# Altium schematic sheet IOControl.SchDoc: Top Level
size A3; CompanyName: NOT USED; SheetNumber: 0; SheetTotal: 0; PageSetup: Record=PageOptions|CenterHorizontal=True|CenterVertical=True|PrintScale=1.00|XCorrection=1.00|YCorrection=1.00|PrintKind=0|BorderSize=5000000|LeftOffset=0|BottomOffset=0|Orientation=2|PaperLength=1000|PaperWidth=1000|Scale=100|PaperSource=7|PrintQuality=-4|MediaType=1|DitherType=10|PaperKind=A3|PrintScaleMode=0
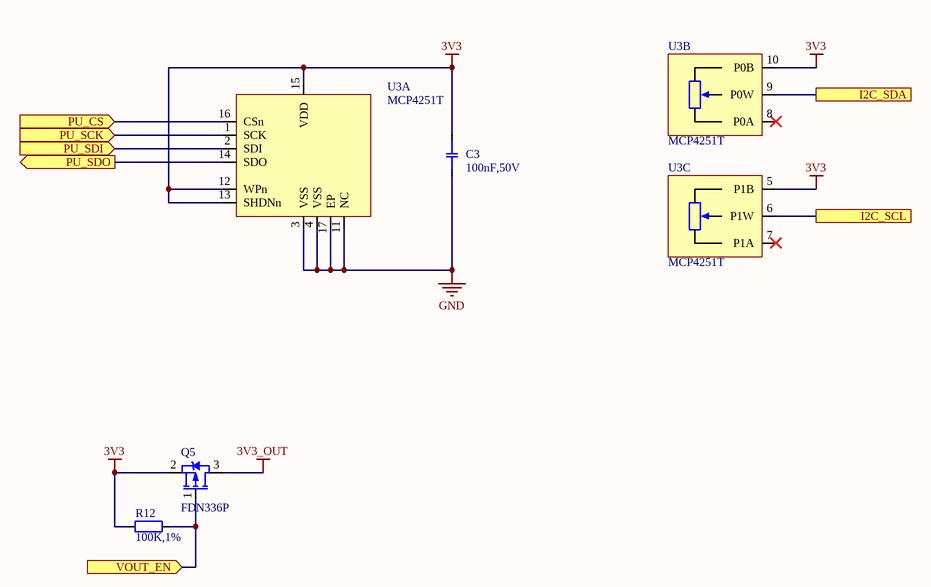
[diagram p0: IOControl.SchDoc]

## Parts
C3  100nF,50V  [CAPC1608X09N_0603]
Q5  FDN336P  [SOT95P230X110-3N_SOT23]
R12  100K,1%  [RESC1608X06N_0603]
U3  MCP4251T  [QFN65P400X400X90_HS-16N]  (parts A,B,C of 3)

## Ports
I2C_SCL, I2C_SDA, PU_CS (in), PU_SCK (in), PU_SDI (in), PU_SDO (out), VOUT_EN (in)

## Nets
3V3: C3.2 Q5.2(S) R12.2 U3.5(P1B) U3.10(P0B) U3.12(WPn) U3.13(SHDNn) U3.15(VDD)
3V3_OUT: Q5.3(D)
GND: C3.1 U3.3(VSS) U3.4(VSS) U3.11(NC) U3.17(EP)
I2C_SCL: U3.6(P1W) ; port I2C_SCL
I2C_SDA: U3.9(P0W) ; port I2C_SDA
PU_CS: U3.16(CSn) ; port PU_CS
PU_SCK: U3.1(SCK) ; port PU_SCK
PU_SDI: U3.2(SDI) ; port PU_SDI
PU_SDO: U3.14(SDO) ; port PU_SDO
VOUT_EN: Q5.1(G) R12.1 ; port VOUT_EN

Not connected (* = marked no-connect by the designer): U3 7(P1A)* 8(P0A)*

## Notes on the sheet
- Project
- Size:
- Date:
- A3
- Revision:
- Sheet
- of
- Lambo
- File:

## Library data of the parts
C3 = CCH-104CH-G: CAP CER 0.1UF 50V 10% X7R 0603; Manufacturer: Kemet; Manufacturer Part Number: C0603C104K5RACTU; Type: Ceramic; Display_Name: 100nF,50V; Capacitance: 100nF; Dielectric: X7R; Tolerance: 10%; Voltage: 50V; BWA PN: CCH-104CH-G; Schematic Symbol: CAP-NP_1; Supplier 1: Digi-Key; Supplier Part Number 1: 399-5089-1-ND
Q5 = TRN-10046-A: MOSFET P-Channel; Manufacturer: Fairchild Semiconductor; Type: P; Id(max): 1.3A; rds(on): 200 mOhm @ 1.3A, 4.5V; Vds(max): 20V; Vgs(max): +/-8V; Vth(max): 1.5V @ 250µA; Display_Name: FDN336P; BWA PN: TRN-10046-A; Schematic Symbol: MOSFET-P_1; Manufacturer Part Number: FDN336P; Supplier 1: Digi-Key; Supplier Part Number 1: FDN336PCT-ND
R12 = RSH-100K0-D: RES 100K OHM 1/10W 1% 0603 SMD; Manufacturer: Yageo; Manufacturer Part Number: RC0603FR-07100KL; Power: 0.1W; Display_Name: 100K,1%; Resistance: 100K; Tolerance: 1%; Type: Chip; BWA PN: RSH-100K0-D; Schematic Symbol: RESISTOR_1; Supplier 1: Digi-Key; Supplier Part Number 1: 311-100KHRCT-ND
U3 = ICT-10921-A: IC DGTL POT 10KOHM 257TAP 16QFN; Manufacturer: Microchip Technology; Manufacturer Part Number: MCP4251T-103E/ML; Temp Range: -40°C ~ 125°C; Display_Name: MCP4251T; BWA PN: ICT-10921-A; Schematic Symbol: MCP4241T-103E; Supplier 1: Digi-Key; Supplier Part Number 1: MCP4251T-103E/MLCT-ND